# EAGLE schematic Schematic_v39 (EAGLE 9.7.0)
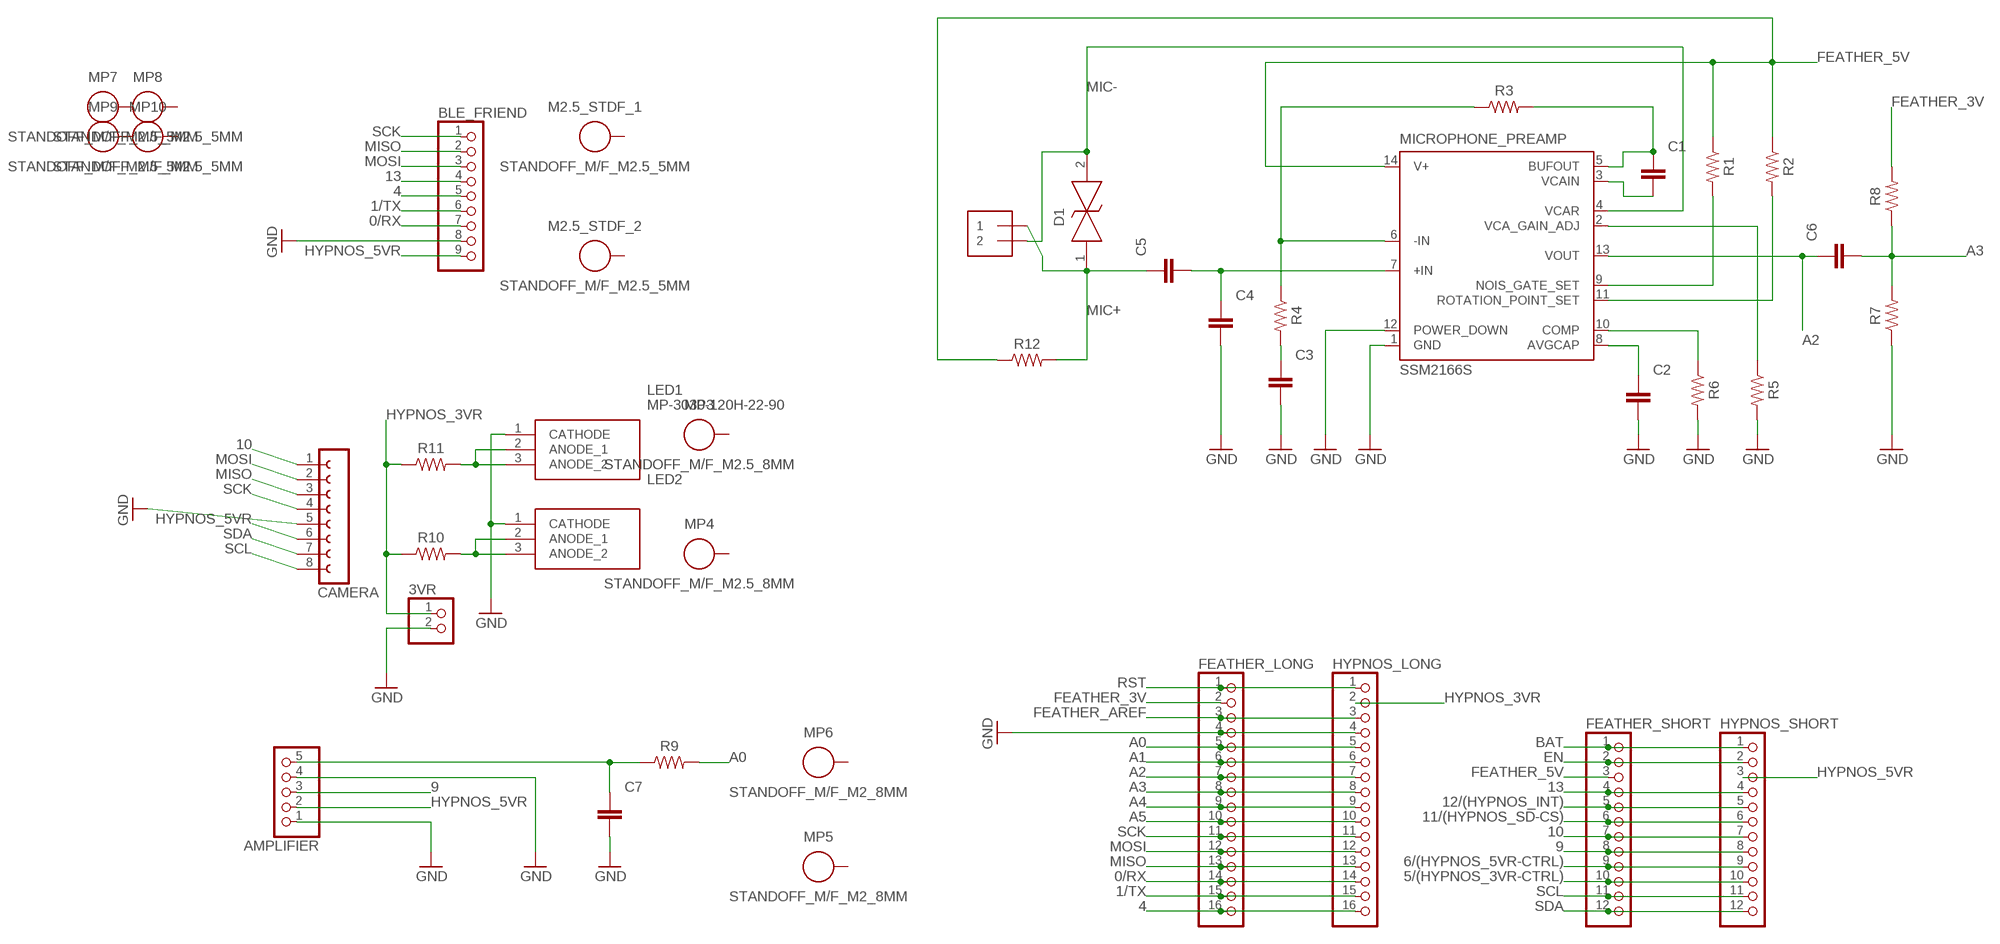
[diagram p0: schematic, sheet 1]

## Parts
3VR  PINHD-1X2  [1X02]
AMPLIFIER  PINHD-1X05_2.54-S  [1X05-S]
BLE_FRIEND  PINHD-1X09_2.54-S  [1X09-S]
C1  C_CHIP-0805(2012-METRIC)  [CAPC2012X110]
C2  C_CHIP-0805(2012-METRIC)  [CAPC2012X110]
C3  C_CHIP-0805(2012-METRIC)  [CAPC2012X110]
C4  C_CHIP-0805(2012-METRIC)  [CAPC2012X110]
C5  C_CHIP-0805(2012-METRIC)  [CAPC2012X110]
C6  C_CHIP-0805(2012-METRIC)  [CAPC2012X110]
C7  C_CHIP-0805(2012-METRIC)  [CAPC2012X110]
CAMERA  FE08W  [FE08W]
D1  STS321033B100  [SOD2613X100N]
FEATHER_LONG  PINHD-1X16_2.54-S  [1X16-S]
FEATHER_SHORT  PINHD-1X12_2.54-S  [1X12-S]
HYPNOS_LONG  PINHD-1X16_2.54-S  [1X16-S]
HYPNOS_SHORT  PINHD-1X12_2.54-S  [1X12-S]
LED1  MP-3030-120H-22-90  [MP3030120H2290]
LED2  MP-3030-120H-22-90  [MP3030120H2290]
M2.5_STDF_1  STANDOFF_M/F_M2.5_5MM  [STANDOFF_HEX_MALE-FEMALE_500X500_M2.5X0.45_MTGP755H270]
M2.5_STDF_2  STANDOFF_M/F_M2.5_5MM  [STANDOFF_HEX_MALE-FEMALE_500X500_M2.5X0.45_MTGP755H270]
MIC_INPT  1X2-3.5MM  [1X2-3.5MM]
MICROPHONE_PREAMP  SSM2166S  [SO14]
MP3  STANDOFF_M/F_M2.5_8MM  [STANDOFF_HEX_MALE-FEMALE_500X800_M2.5X0.45_MTGP755H270]
MP4  STANDOFF_M/F_M2.5_8MM  [STANDOFF_HEX_MALE-FEMALE_500X800_M2.5X0.45_MTGP755H270]
MP5  STANDOFF_M/F_M2_8MM  [STANDOFF_HEX_MALE-FEMALE_400X800_M2X0.4_MTGP600H220]
MP6  STANDOFF_M/F_M2_8MM  [STANDOFF_HEX_MALE-FEMALE_400X800_M2X0.4_MTGP600H220]
MP7  STANDOFF_M/F_M2.5_5MM  [STANDOFF_HEX_MALE-FEMALE_500X500_M2.5X0.45_MTGP755H270]
MP8  STANDOFF_M/F_M2.5_5MM  [STANDOFF_HEX_MALE-FEMALE_500X500_M2.5X0.45_MTGP755H270]
MP9  STANDOFF_M/F_M2.5_5MM  [STANDOFF_HEX_MALE-FEMALE_500X500_M2.5X0.45_MTGP755H270]
MP10  STANDOFF_M/F_M2.5_5MM  [STANDOFF_HEX_MALE-FEMALE_500X500_M2.5X0.45_MTGP755H270]
R1  R-US_CHIP-1206(3216-METRIC)  [RESC3216X70]
R2  R-US_CHIP-1206(3216-METRIC)  [RESC3216X70]
R3  R-US_CHIP-1206(3216-METRIC)  [RESC3216X70]
R4  R-US_CHIP-1206(3216-METRIC)  [RESC3216X70]
R5  R-US_CHIP-1206(3216-METRIC)  [RESC3216X70]
R6  R-US_CHIP-1206(3216-METRIC)  [RESC3216X70]
R7  R-US_CHIP-1206(3216-METRIC)  [RESC3216X70]
R8  R-US_CHIP-1206(3216-METRIC)  [RESC3216X70]
R9  R-US_CHIP-1206(3216-METRIC)  [RESC3216X70]
R10  R-US_CHIP-1206(3216-METRIC)  [RESC3216X70]
R11  R-US_CHIP-1206(3216-METRIC)  [RESC3216X70]
R12  R-US_CHIP-1206(3216-METRIC)  [RESC3216X70]

## Nets
0/RX: BLE_FRIEND.7 FEATHER_LONG.14 HYPNOS_LONG.14
1/TX: BLE_FRIEND.6 FEATHER_LONG.15 HYPNOS_LONG.15
4: BLE_FRIEND.5 FEATHER_LONG.16 HYPNOS_LONG.16
5/(HYPNOS_3VR-CTRL): FEATHER_SHORT.10 HYPNOS_SHORT.10
6/(HYPNOS_5VR-CTRL): FEATHER_SHORT.9 HYPNOS_SHORT.9
9: AMPLIFIER.3 FEATHER_SHORT.8 HYPNOS_SHORT.8
10: CAMERA.1 FEATHER_SHORT.7 HYPNOS_SHORT.7
11/(HYPNOS_SD-CS): FEATHER_SHORT.6 HYPNOS_SHORT.6
12/(HYPNOS_INT): FEATHER_SHORT.5 HYPNOS_SHORT.5
13: BLE_FRIEND.4 FEATHER_SHORT.4 HYPNOS_SHORT.4
A0: FEATHER_LONG.5 HYPNOS_LONG.5 R9.2
A1: FEATHER_LONG.6 HYPNOS_LONG.6
A2: C6.1 FEATHER_LONG.7 HYPNOS_LONG.7 MICROPHONE_PREAMP.13(VOUT)
A3: C6.2 FEATHER_LONG.8 HYPNOS_LONG.8 R7.2 R8.1
A4: FEATHER_LONG.9 HYPNOS_LONG.9
A5: FEATHER_LONG.10 HYPNOS_LONG.10
AVGCAP: C2.1 MICROPHONE_PREAMP.8(AVGCAP)
BAT: FEATHER_SHORT.1 HYPNOS_SHORT.1
BUFOUT: C1.1 MICROPHONE_PREAMP.5(BUFOUT) R3.2
COMP: MICROPHONE_PREAMP.10(COMP) R6.1
EN: FEATHER_SHORT.2 HYPNOS_SHORT.2
FEATHER_3V: FEATHER_LONG.2 R8.2
FEATHER_5V: FEATHER_SHORT.3 MICROPHONE_PREAMP.14(V+) R1.1 R2.1 R12.1
FEATHER_AREF: FEATHER_LONG.3 HYPNOS_LONG.3
GND: 3VR.2 AMPLIFIER.1 AMPLIFIER.4 BLE_FRIEND.8 C2.2 C3.2 C4.2 C7.2 CAMERA.5 FEATHER_LONG.4 HYPNOS_LONG.4 LED1.1(CATHODE) LED2.1(CATHODE) MICROPHONE_PREAMP.1(GND) MICROPHONE_PREAMP.12(POWER_DOWN) R5.2 R6.2 R7.1
HYPNOS_3VR: 3VR.1 HYPNOS_LONG.2 R10.1 R11.1
HYPNOS_5VR: AMPLIFIER.2 BLE_FRIEND.9 CAMERA.6 HYPNOS_SHORT.3
IN+: C4.1 C5.2 MICROPHONE_PREAMP.7(+IN)
IN-: MICROPHONE_PREAMP.6(-IN) R3.1 R4.1
MIC+: C5.1 D1.1 MIC_INPT.1 R12.2
MIC-: D1.2 MIC_INPT.2 MICROPHONE_PREAMP.4(VCAR)
MISO: BLE_FRIEND.2 CAMERA.3 FEATHER_LONG.13 HYPNOS_LONG.13
MOSI: BLE_FRIEND.3 CAMERA.2 FEATHER_LONG.12 HYPNOS_LONG.12
N$1: LED1.2(ANODE_1) LED1.3(ANODE_2) R11.2
N$8: C3.1 R4.2
N$14: AMPLIFIER.5 C7.1 R9.1
N$15: LED2.2(ANODE_1) LED2.3(ANODE_2) R10.2
RGAIN: MICROPHONE_PREAMP.2(VCA_GAIN_ADJ) R5.1
RNOISE: MICROPHONE_PREAMP.9(NOIS_GATE_SET) R1.2
RROT: MICROPHONE_PREAMP.11(ROTATION_POINT_SET) R2.2
RST: FEATHER_LONG.1 HYPNOS_LONG.1
SCK: BLE_FRIEND.1 CAMERA.4 FEATHER_LONG.11 HYPNOS_LONG.11
SCL: CAMERA.8 FEATHER_SHORT.11 HYPNOS_SHORT.11
SDA: CAMERA.7 FEATHER_SHORT.12 HYPNOS_SHORT.12
VCAIN: C1.2 MICROPHONE_PREAMP.3(VCAIN)
Unconnected: M2.5_STDF_1.1 M2.5_STDF_2.1 MP3.1 MP4.1 MP5.1 MP6.1 MP7.1 MP8.1 MP9.1 MP10.1

## Library data of the parts
3VR = pinhead:PINHD-1X2: PIN HEADER
AMPLIFIER = pinhead-2:PINHD-1X05: PIN HEADER
BLE_FRIEND = pinhead-2:PINHD-1X09: PIN HEADER
C1-C7 = Capacitor:C: Capacitor - Generic; CATEGORY: Capacitor
CAMERA = con-lsta:FE08W: FEMALE HEADER; OC_FARNELL: unknown; OC_NEWARK: unknown
D1 = SamacSys_Parts:STS321033B100: ESD Suppressors / TVS Diodes TVS ESD SOD-323 3.3 V Source: Datasheet <https://www.eaton.com/content/dam/eaton/products/electronic-components/resources/data-sheet/eaton-sts321xxxbxx0-tvs-diode-esd-suppressor-data-sheet.pdf>; DESCRIPTION: ESD Suppressors / TVS Diodes TVS ESD SOD-323 3.3 V; HEIGHT: 1mm; MANUFACTURER_NAME: Eaton; MANUFACTURER_PART_NUMBER: STS321033B100
FEATHER_LONG HYPNOS_LONG = pinhead-2:PINHD-1X16: PIN HEADER
FEATHER_SHORT HYPNOS_SHORT = pinhead-2:PINHD-1X12: PIN HEADER
LED1 LED2 = SamacSys_Parts:MP-3030-120H-22-90: High Power LEDs - White White 2200K ,90CRI Source: Datasheet <https://download.luminus.com/datasheets/PDS-002981_Rev00_Mid_Power_3030-120H_preliminary.pdf>; DESCRIPTION: High Power LEDs - White White 2200K ,90CRI; HEIGHT: 0.71mm; MANUFACTURER_NAME: Luminus Devices Inc.; MANUFACTURER_PART_NUMBER: MP-3030-120H-22-90; MOUSER_PART_NUMBER: 896-MP303012H2290; MOUSER_PRICE-STOCK: https://www.mouser.co.uk/ProductDetail/Luminus-Devices/MP-3030-120H-22-90?qs=iLbezkQI%252BsghKpkN4HJWNA%3D%3D
M2.5_STDF_1 M2.5_STDF_2 MP3-MP10 = PCB-Fasteners_Hardware:STANDOFF_M/F: Male-Male Standoff/Spacer with Mounting pad and hole. Essentra : Male-Female Standoff <https://www.essentracomponents.co.in/index.php?option=com_virtuemart&view=productdetails&virtuemart_product_id=14556> The hole and pad sizes may vary based on the application and type of hardware; always verify the Manufacturer specification or Global Standards.; CATEGORY: Standoff/Spacer; SUB-CATEGORY: Male-Female
MIC_INPT = adafruit:1X2: 3.5mm Terminal block http://www.ladyada.net/library/pcb/eaglelibrary.html
MICROPHONE_PREAMP = analog-devices:SSM2166: Microphone Preamplifier with Variable Compression and Noise Gating Source: http://www.analog.com/static/imported-files/data_sheets/SSM2166.pdf; MF: ALTERA CORPORATION; MPN: SSM2166S-REEL; OC_FARNELL: 1424669; OC_NEWARK: 13B4818
R1-R12 = Resistor:R-US: Resistor Fixed - ANSI; CATEGORY: Resistor; SUB-CATEGORY: Fixed